# EAGLE schematic remote (EAGLE 6.4)
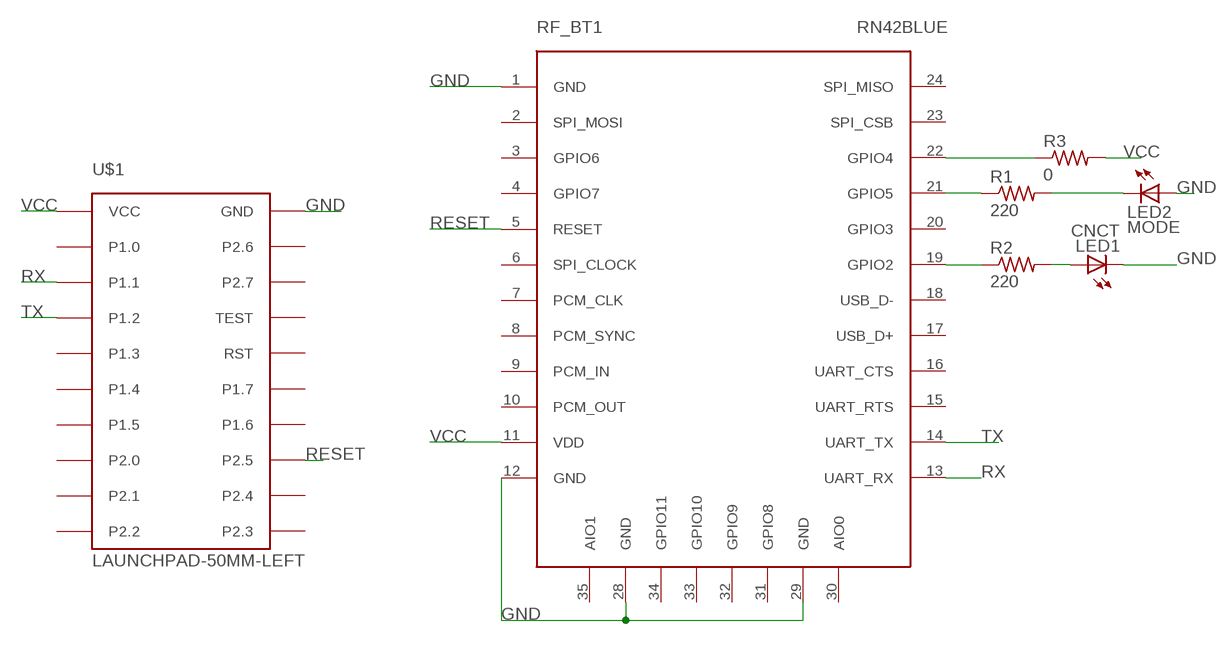
[diagram p0: schematic, sheet 1]

## Parts
LED1  CNCT  LEDCHIPLED_0603  [CHIPLED_0603]
LED2  MODE  LEDCHIPLED_0603  [CHIPLED_0603]
R1  220  R-US_R0603  [R0603]
R2  220  R-US_R0603  [R0603]
R3  0  R-US_R0603  [R0603]
RF_BT1  RN42BLUE  [RN42_CUST_PAK]
U$1  LAUNCHPAD-50MM-LEFT  [LAUNCHPAD-50MM-LEFT]

## Nets
GND: LED1.C LED2.A RF_BT1.1(GND) RF_BT1.12(GND) RF_BT1.28(GND) RF_BT1.29(GND) U$1.GND
N$1: R1.1 RF_BT1.21(GPIO5)
N$2: R2.1 RF_BT1.19(GPIO2)
N$3: LED2.C R1.2
N$4: LED1.A R2.2
N$5: R3.1 RF_BT1.22(GPIO4)
RESET: RF_BT1.5(RESET) U$1.P2.5
RX: RF_BT1.13(UART_RX) U$1.P1.1
TX: RF_BT1.14(UART_TX) U$1.P1.2
VCC: R3.2 RF_BT1.11(VDD) U$1.VCC
Unconnected: RF_BT1.2(SPI_MOSI) RF_BT1.3(GPIO6) RF_BT1.4(GPIO7) RF_BT1.6(SPI_CLOCK) RF_BT1.7(PCM_CLK) RF_BT1.8(PCM_SYNC) RF_BT1.9(PCM_IN) RF_BT1.10(PCM_OUT) RF_BT1.15(UART_RTS) RF_BT1.16(UART_CTS) RF_BT1.17(USB_D+) RF_BT1.18(USB_D-) RF_BT1.20(GPIO3) RF_BT1.23(SPI_CSB) RF_BT1.24(SPI_MISO) RF_BT1.30(AIO0) RF_BT1.31(GPIO8) RF_BT1.32(GPIO9) RF_BT1.33(GPIO10) RF_BT1.34(GPIO11) RF_BT1.35(AIO1) U$1.P1.0 U$1.P1.3 U$1.P1.4 U$1.P1.5 U$1.P1.6 U$1.P1.7 U$1.P2.0 U$1.P2.1 U$1.P2.2 U$1.P2.3 U$1.P2.4 U$1.P2.6 U$1.P2.7 U$1.RST U$1.TEST

## Library data of the parts
LED1 LED2 = adafruit:LED: LED OSRAM: - CHIPLED LG R971, LG N971, LY N971, LG Q971, LY Q971, LO R971, LY R971 LH N974, LH R974 LS Q976, LO Q976, LY Q976 LO Q996 - Hyper CHIPLED LW Q18S LB Q993, LB Q99A, LB R99A - SideLED LS A670, LO A670, LY A670, LG A670, LP A670 LB A673, LV A673, LT A673, LW A673 LH A674 LY A675 LS A676, LA A676, LO A676, LY A676, LW A676 LS A679, LY A679, LG A679 - Hyper Micro SIDELED® LS Y876, LA Y876, LO Y876, LY Y876 LT Y87S - SmartLED LW L88C, LW L88S LB L89C, LB L89S, LG L890 LS L89K, LO L89K, LY L89K LS L896, LA L896, LO L896, LY L896 - TOPLED LS T670, LO T670, LY T670, LG T670, LP T670 LSG T670, LSP T670, LSY T670, LOP T670, LYG T670 LG T671, LOG T671, LSG T671 LB T673, LV T673, LT T673, LW T673 LH T674 LS T676, LA T676, LO T676, LY T676, LB T676, LH T676, LSB T676, LW T676 LB T67C, LV T67C, LT T67C, LS T67K, LO T67K, LY T67K, LW E67C LS E67B, LA E67B, LO E67B, LY E67B, LB E67C, LV E67C, LT E67C LW T67C LS T679, LY T679, LG T679 LS T770, LO T770, LY T770, LG T770, LP T770 LB T773, LV T773, LT T773, LW T773 LH T774 LS E675, LA E675, LY E675, LS T675 LS T776, LA T776, LO T776, LY T776, LB T776 LHGB T686 LT T68C, LB T68C - Hyper Mini TOPLED® LB M676 - Mini TOPLED Santana® LG M470 LS M47K, LO M47K, LY M47K Source: http://www.osram.convergy.de/
R1-R3 = adafruit:R-US_: RESISTOR, American symbol
RF_BT1 = RN42:RN42: RN42 Bluetooth Module Product data sheets and resources: http://www.rovingnetworks.com/products/RN42 Purchase from SparkFun: https://www.sparkfun.com/products/10253 Features Bluetooth Versions :2.1 + EDR, 2.0, 1.2, 1.1 Data rate: 300Kbps: HCI mode: 1.5Mbps sustained, 3Mbps burst Frequency Band: 2.412 - 2.484 GHz Modulation: FHSS/GFSK modulation, 79 channels at 1MHz intervals Profiles: SPP, DUN, HID, iAP, HCI, RFCOM, L2CAP, SDP Supply voltage: 3.3V ± 10% Output power: +4dBm Interface UART, USB, Bluetooth Size 0.52" x 1" x 0.07" (13.4mm x 25.8mm x 2mm)
U$1 = TI_launchpad:LAUNCHPAD: MSP-EXP430G2 LaunchPad Booster Pack layouts. LAUNCHPAD: Full-size board. LAUNCHPAD-50MM: 50x50mm board covering the button area. LAUNCHPAD-50MM-LEFT: 50x50mm board leaving the button area open. Tall LaunchPad components marked on Reference for reference.